# EasyEDA Pro project TJMakes_LiPo_Manager.eprj

# Schematic schematic1
Create Date: 2024-02-23; Page Name: P1; Project Name: TJMakes_LiPo_Manager; Schematic Name: schematic1; Update Date: 2024-02-23; Company: EasyEDA.com; Drawn: EasyEDA; Page Size: A4; Part Number: JLCPCB-002; Reviewed: EasyEDA; Version: V0.1
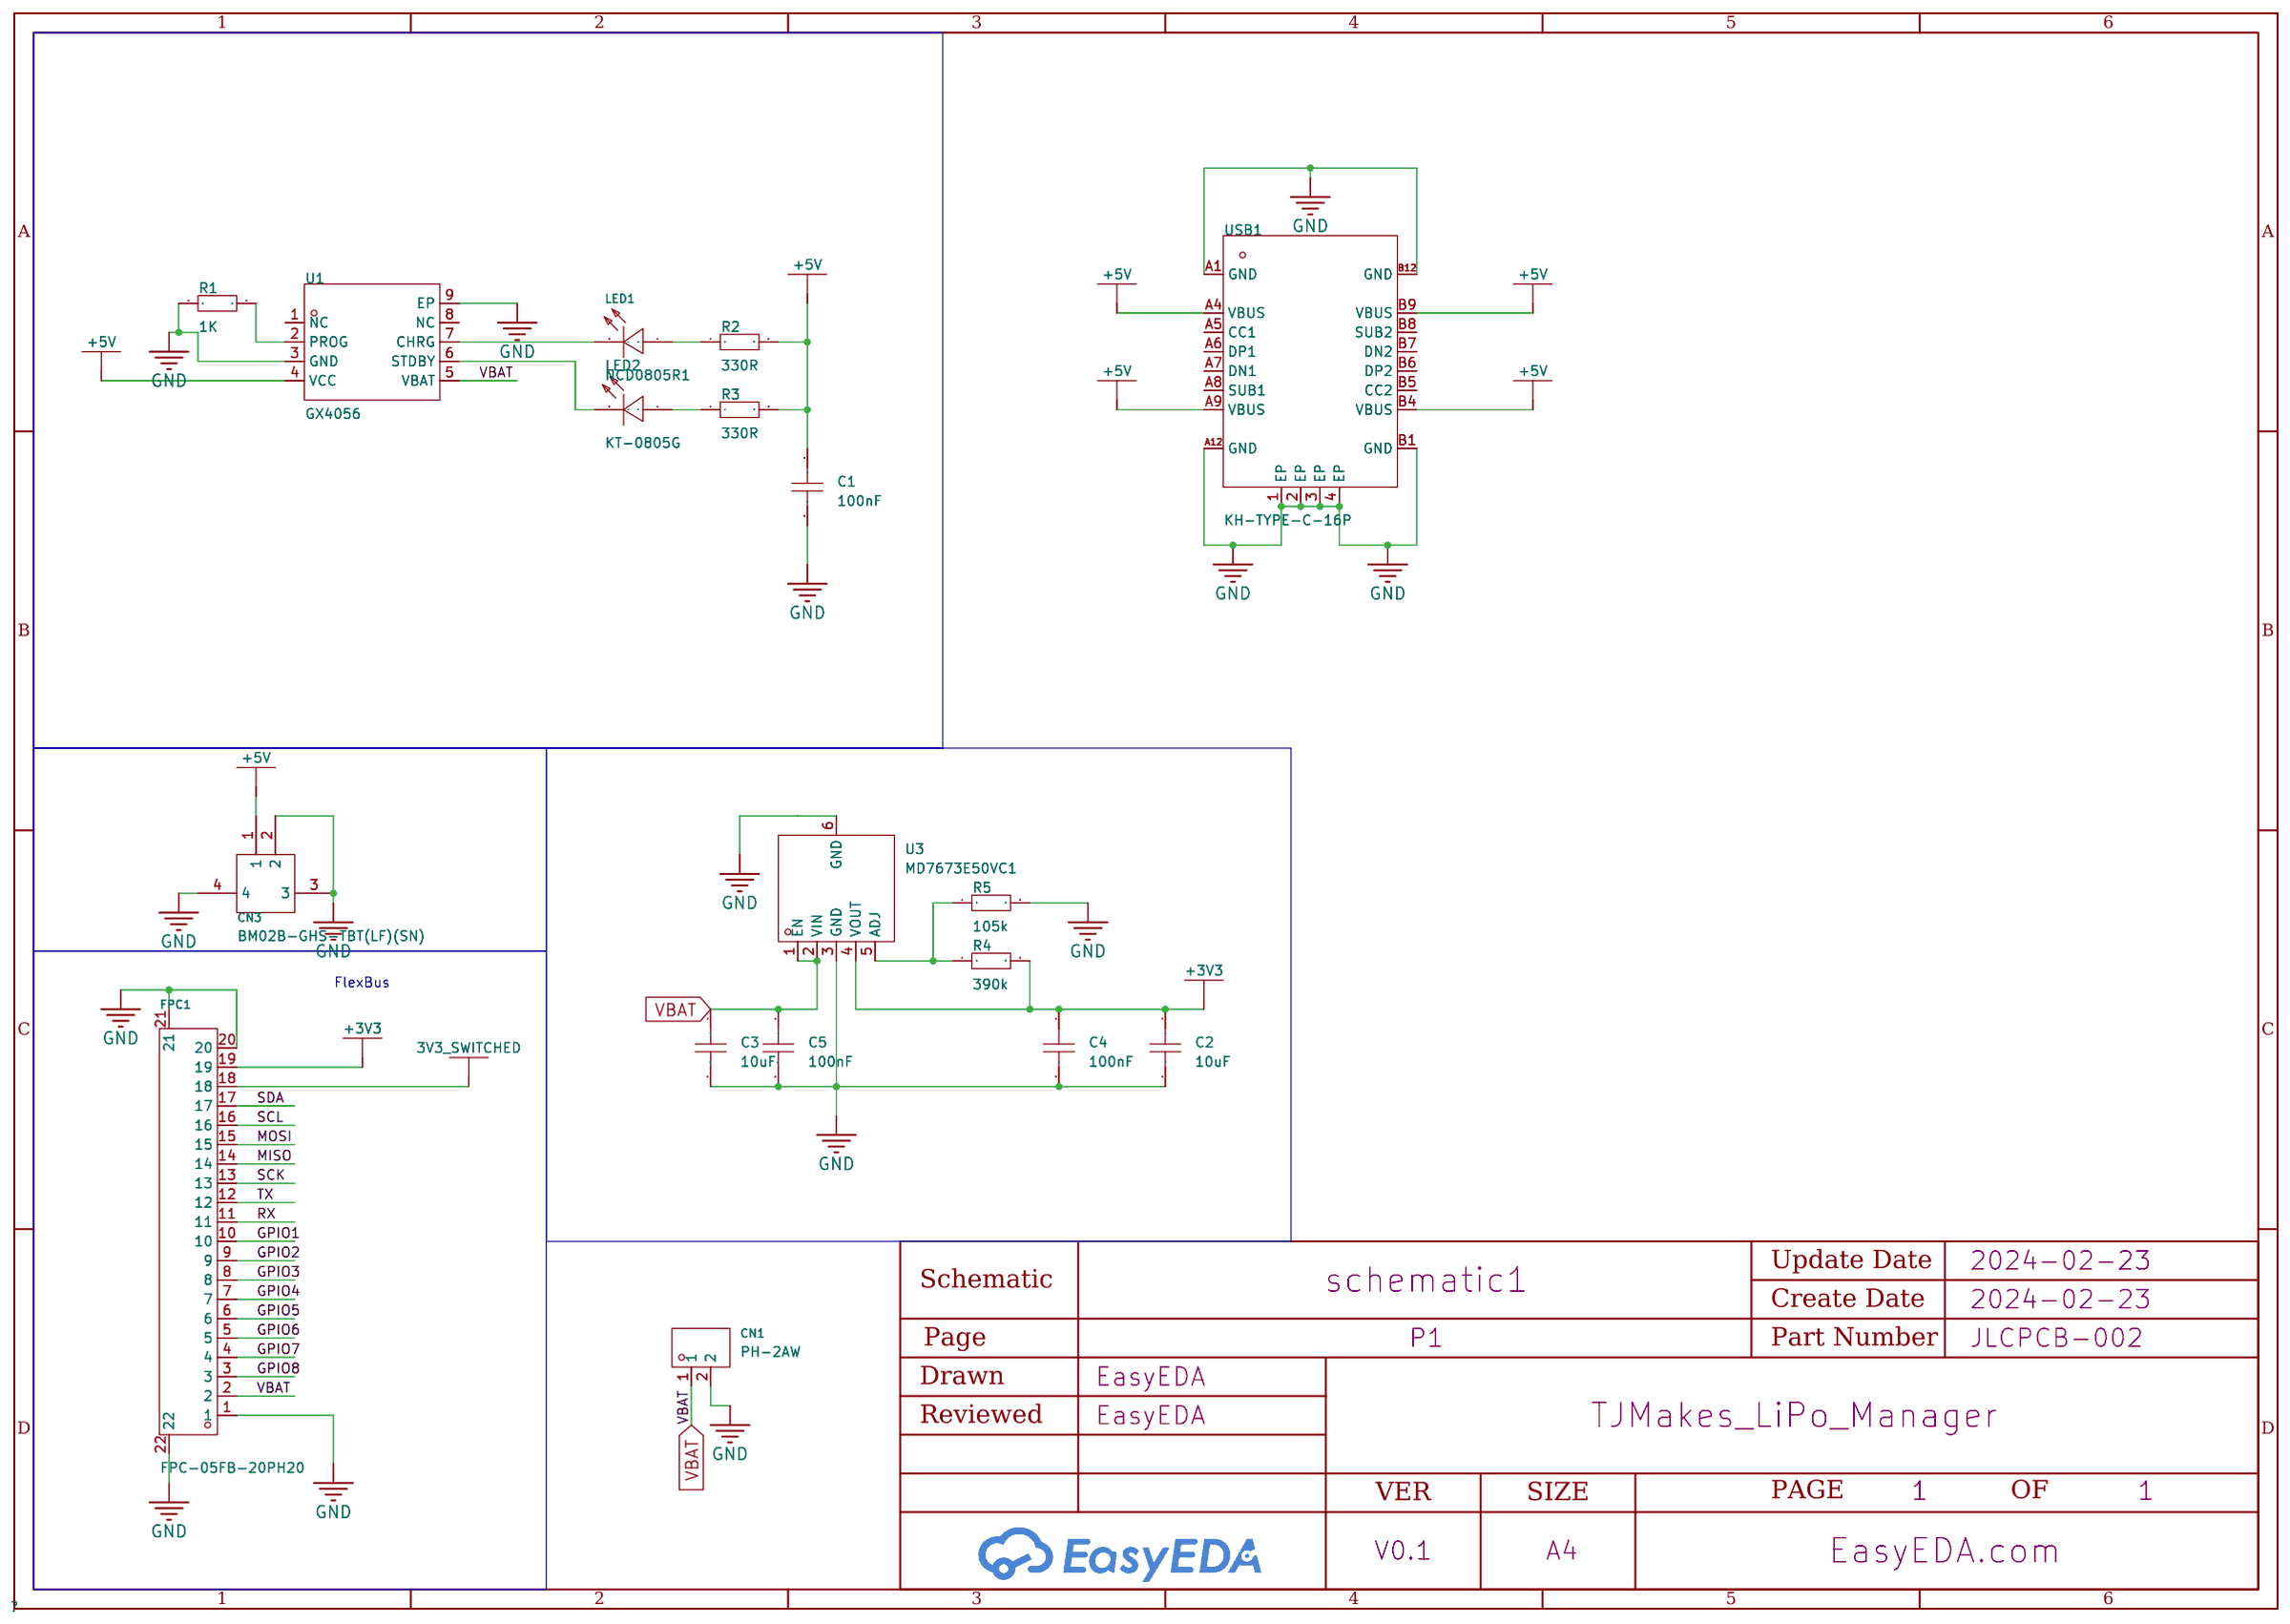
[diagram p0: schematic sheet]

## Parts
C1  100nF  [C0603]
C2  10uF  [C0603]
C3  10uF  [C0603]
C4  100nF  [C0603]
C5  100nF  [C0603]
CN1  PH-2AW  [CONN-TH_PH-2AW]
CN3  BM02B-GHS-TBT(LF)(SN)  [CONN-SMD_2P-P1.25_BM02B-GHS-TBT-LF-SN]
FPC1  FPC-05FB-20PH20  [FPC-SMD_20P-P0.50_FPC-05FB-20PH20]
LED1  NCD0805R1  [LED0805-R-RD]
LED2  KT-0805G  [LED0805-R-RD]
R1  1K  [R0603]
R2  330R  [R0603]
R3  330R  [R0603]
R4  390k  [R0603]
R5  105k  [R0603]
U1  GX4056  [ESOP-8_L4.9-W3.9-P1.27-LS6.0-BL-EP]
U3  MD7673E50VC1  [TO-263-5_L10.2-W8.9-P1.70-BR]
USB1  KH-TYPE-C-16P  [USB-C-SMD_KH-TYPE-C-16P]

## Library data of the parts
C1-C5 = CAP_0603: Supplier Footprint: 0603
CN1 = PH-2AW_C722769: Pins Structure:1x2P Pitch:2mm Mounting Style:Right-Angle Row Spacing:- Number of Pins:2P Number of Rows:1 Number of PINs Per Row:2 Reference Series:- Current Rating (Max):2A Operating Temperature Range:-25℃~+85℃ Operating Temperature Range:-25℃~+85℃; LCSC Part Name: 1x2P 间距:2mm 弯插; Supplier Part: C722769; Manufacturer: CAX(创都); Supplier Footprint: 弯插,P=2mm; JLCPCB Part Class: Extended Part; Datasheet: https://atta.szlcsc.com/upload/public/pdf/source/20200902/C722754_1EABA69888C87343FC10590ADF2409DD.pdf; Supplier: LCSC; Pins Structure: 1x2P; Pitch: 2mm; Mounting Style: Right-Angle; Number of Pins: 2P; Number of Rows: 1; Number of PINs Per Row: 2; Current Rating (Max): 2A; Operating Temperature Range: -25℃~+85℃
CN3 = BM02B-GHS-TBT(LF)(SN)_C161690: Pins Structure:1x2P Pitch:1.25mm Mounting Style:- Reference Series:GH Number of Pins:2P Number of Rows:1 Number of PINs Per Row:2 Row Spacing:- Contact Material:Phosphor bronze; LCSC Part Name: 系列:GH 间距:1.25mm 1x2P; Supplier Part: C161690; Manufacturer: JST; Supplier Footprint: SMD,P=1.25mm; JLCPCB Part Class: Extended Part; Datasheet: https://atta.szlcsc.com/upload/public/pdf/source/20181009/C265379_627E5111B25906DAAB327E382701D435.pdf; Supplier: LCSC; Pins Structure: 1x2P; Pitch: 1.25mm; Reference Series: GH; Number of Pins: 2P; Number of Rows: 1; Number of PINs Per Row: 2; Contact Material: Phosphor bronze
FPC1 = FPC-05FB-20PH20: Pitch:0.5mm Number of Contacts:20P Locking Feature:Clamshell FFC, FCB Thickness:0.3mm FFC, FCB Thickness:0.3mm Contact Type:Double-sided contacts/up and down connection Mounting Type:Surface Mount Height Above Board:2mm Operating Temperature Range:-25℃~+8; LCSC Part Name: 间距:0.5mm P数:20P 翻盖式 双侧触点/上下接; Supplier Part: C2856830; Manufacturer: XUNPU(讯普); Supplier Footprint: SMD,P=0.5mm,卧贴; JLCPCB Part Class: Extended Part; Datasheet: https://atta.szlcsc.com/upload/public/pdf/source/20210922/C2856830_32DC95BE77527398880E7D75F765EF2A.pdf; Supplier: LCSC; Pitch: 0.5mm; Number of Contacts: 20P; Locking Feature: Clamshell; FFC, FCB Thickness: 0.3mm; Contact Type: Double-sided contacts/up and down connection; Mounting Type: Surface Mount; Height Above Board: 2mm; Operating Temperature Range: -25℃~+85℃
LED1 = NCD0805R1_C84256: Lamp Holder Type:- Emitted Color:Red Forward Voltage (VF):1.6V~2.6V Forward Voltage (VF):1.6V~2.6V Power Dissipation:65mW Forward Current:20mA Dominant Wavelength:615nm~630nm Dominant Wavelength:615nm~630nm Peak Wavelength:- Diode Configuration:独立二极管 Lens; Supplier Part: C84256; Manufacturer: 国星光电; Supplier Footprint: 0805; JLCPCB Part Class: Basic Part; Datasheet: https://atta.szlcsc.com/upload/public/pdf/source/20200820/C84256_F0A75A43B3EAD75808600A0514C76B99.pdf; Supplier: LCSC; Emitted Color: Red; Forward Voltage (VF): 1.6V~2.6V; Power Dissipation: 65mW; Forward Current: 20mA; Dominant Wavelength: 615nm~630nm; Diode Configuration: 独立二极管; Lens Color: 无色透明; Luminous Intensity: 67mcd~195mcd; Viewing Angle: 130°; Operating Temperature: -30℃~+85℃
LED2 = KT-0805G: Emitted Color:Emerald Diode Configuration:- Lamp Holder Type:- Forward Voltage (VF):- Forward Voltage (VF):- Forward Current:- Power Dissipation:- Lens Color:- Dominant Wavelength:- Dominant Wavelength:- Peak Wavelength:- Color Temperature:- Color Tempera; LCSC Part Name: 0805 翠绿 高亮; Supplier Part: C2297; Manufacturer: KENTO; Supplier Footprint: 0805; JLCPCB Part Class: Basic Part; Datasheet: https://atta.szlcsc.com/upload/public/pdf/source/20170209/1486607340485.pdf; Supplier: LCSC; Emitted Color: Emerald
R1-R5 = Res_0603: Supplier Footprint: 0603
U1 = GX4056: Maximum Charge Current:1000mA; Supplier Part: C5259236; Manufacturer: 国芯佳品; Supplier Footprint: SOP-8-EP; JLCPCB Part Class: Extended Part; Datasheet: https://atta.szlcsc.com/upload/public/pdf/source/20221111/1186739FA5174D5673D9C2FF440403FD.pdf; Supplier: LCSC; Maximum Charge Current: 1000mA
U3 = MD7673E50VC1: Output Type: Maximum Input Voltage:6V Output Voltage:1.2V~5V Output Voltage:1.2V~5V MAX Output Current:2A Output Polarity:Positive electrode Number of Outputs:1; LCSC Part Name: 输入6V 输出1.2V~5V 2000mA; Supplier Part: C920528; Manufacturer: 明达微; Supplier Footprint: TO-263-5; JLCPCB Part Class: Extended Part; Datasheet: https://atta.szlcsc.com/upload/public/pdf/source/20201124/C920528_9A3F83070614AE6999C6B638A60BE80A.pdf; Supplier: LCSC; Maximum Input Voltage: 6V; Output Voltage: 1.2V~5V; MAX Output Current: 2A; Output Polarity: Positive electrode; Number of Outputs: 1
USB1 = KH-TYPE-C-16P: Connector Type:Type-C Standard:- Gender:Female Number of Ports:1 Number of Contacts:16P Mounting Style:卧贴 Current Rating - Power (Max):3A Operating Temperature Range:-40℃~+85℃ Operating Temperature Range:-40℃~+85℃; LCSC Part Name: Type-C 母 卧贴; Supplier Part: C709357; Manufacturer: kinghelm(金航标); Supplier Footprint: SMD; JLCPCB Part Class: Extended Part; Datasheet: https://atta.szlcsc.com/upload/public/pdf/source/20200911/C709357_AA8DCEB38BB20E3035A7ED7AE7667837.pdf; Supplier: LCSC; Connector Type: Type-C; Gender: Female; Number of Ports: 1; Number of Contacts: 16P; Mounting Style: 卧贴; Current Rating - Power (Max): 3A; Operating Temperature Range: -40℃~+85℃

## Nets
3V3_SWITCHED: FPC1.18
+3V3: C2.1 C4.1 FPC1.19 R4.2 U3.4(VOUT)
+5V: C1.1 CN3.1 R2.2 R3.2 U1.4(VCC) USB1.A4(VBUS) USB1.A9(VBUS) USB1.B4(VBUS) USB1.B9(VBUS)
GND: C1.2 C2.2 C3.2 C4.2 C5.2 CN1.2 CN3.2 CN3.3 CN3.4 FPC1.1 FPC1.20 FPC1.21 FPC1.22 R1.1 R5.2 U1.3(GND) U1.9(EP) U3.3(GND) U3.6(GND) USB1.1(EP) USB1.2(EP) USB1.3(EP) USB1.4(EP) USB1.A1(GND) USB1.A12(GND) USB1.B1(GND) USB1.B12(GND)
VBAT: C3.1 C5.1 CN1.1 FPC1.2 U1.5(VBAT) U3.1(EN) U3.2(VIN)
GPIO1: FPC1.10
GPIO2: FPC1.9
GPIO3: FPC1.8
GPIO4: FPC1.7
GPIO5: FPC1.6
GPIO6: FPC1.5
GPIO7: FPC1.4
GPIO8: FPC1.3
MISO: FPC1.14
MOSI: FPC1.15
RX: FPC1.11
SCK: FPC1.13
SCL: FPC1.16
SDA: FPC1.17
TX: FPC1.12
$1N4723: R1.2 U1.2(PROG)
$1N4935: LED1.2(-) U1.7(CHRG)
$1N4938: LED2.2(K) U1.6(STDBY)
$1N5268: LED1.1(+) R2.1
$1N5271: LED2.1(A) R3.1
$1N7197: R4.1 R5.1 U3.5(ADJ)

Not connected (* = marked no-connect by the designer): U1 1(NC) 8(NC); USB1 A5(CC1) A6(DP1) A7(DN1) A8(SUB1) B5(CC2) B6(DP2) B7(DN2) B8(SUB2)

## Notes on the sheet
- FlexBus

# Board PCB1
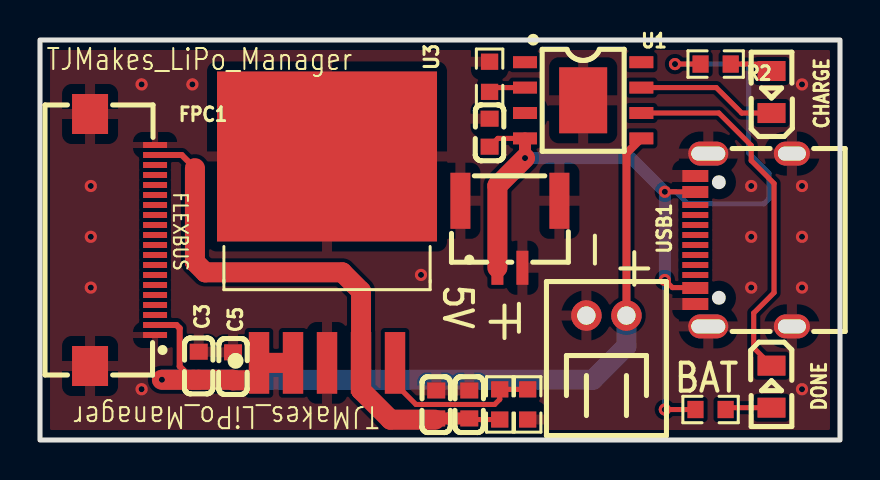
[diagram p1: board, top side]
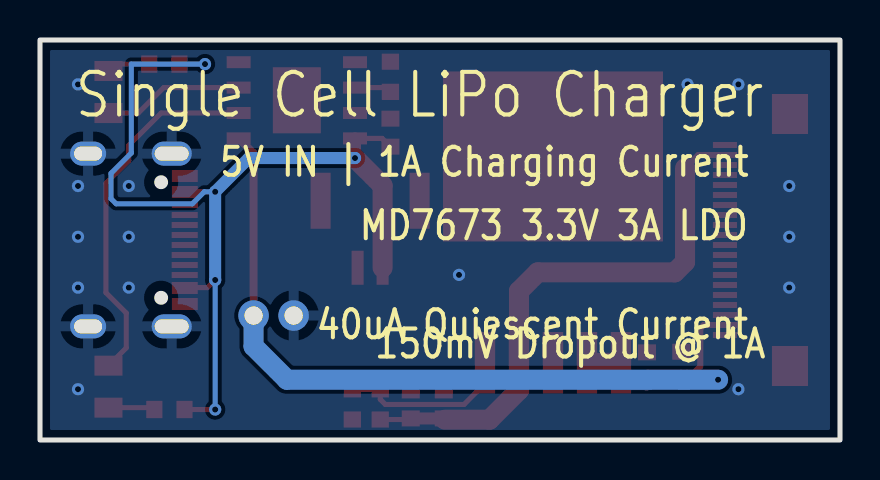
[diagram p2: board, bottom side, seen from below]

Outline 40 x 20 mm; copper layers: Top Layer, Bottom Layer. Coordinates in mm from the lower left corner of the outline.
Outline path: rectangle 0,20 40,0
Stack: Top Layer 0.035mm / Dielectric1 1.51mm FR4 er 4.5 / Bottom Layer 0.035mm

## Design rules (mm)
template: JLCPCB Capability(Two Layers Board)
spacing copperThickness1oz (default): track to track 0.102, other pairs 0.152 to 0.3
spacing copperThickness2oz: track to track 0.203, other pairs 0.152 to 0.3
track width copperThickness1oz (default): min 0.127, default 0.254, max 2.54
track width copperThickness2oz: min 0.203, default 0.254, max 2.54
differential pair differentialPair (default): width min 0.127, default 0.254, max 2.54; gap min 0.152, default 0.152
via viaSize (default): diameter min 0.5, default 0.61, max 10; hole min 0.3, default 0.305, max 6.3

## Placement (name value [footprint] x y rotation side)
C1  100nF  [C0603]  22.48 15.37 90 top
C2  10uF  [C0603]  21.46 1.78 90 top
C3  10uF  [C0603]  7.94 3.71 90 top
C4  100nF  [C0603]  19.81 1.78 90 top
C5  100nF  [C0603]  9.65 3.68 90 top
CN1  PH-2AW  [CONN-TH_PH-2AW]  28.32 6.22 0 top
CN3  BM02B-GHS-TBT(LF)(SN)  [CONN-SMD_2P-P1.25_BM02B-GHS-TBT-LF-SN]  23.5 10.29 180 top
FPC1  FPC-05FB-20PH20  [FPC-SMD_20P-P0.50_FPC-05FB-20PH20]  4.13 10 270 top
LED1  NCD0805R1  [LED0805-R-RD]  36.58 17.4 90 top
LED2  KT-0805G  [LED0805-R-RD]  36.58 2.67 270 top
R1  1K  [R0603]  22.48 18.16 270 top
R2  330R  [R0603]  33.78 18.8 180 top
R3  330R  [R0603]  33.53 1.52 180 top
R4  390k  [R0603]  22.99 1.78 270 top
R5  105k  [R0603]  24.38 1.78 270 top
U1  GX4056  [ESOP-8_L4.9-W3.9-P1.27-LS6.0-BL-EP]  27.16 16.98 270 top
U3  MD7673E50VC1  [TO-263-5_L10.2-W8.9-P1.70-BR]  14.35 9.02 270 top
USB1  KH-TYPE-C-16P  [USB-C-SMD_KH-TYPE-C-16P]  35.18 10 90 top

## Footprints (pads in the part's own frame, mm; a bottom-side part is the same pattern mirrored in y, then rotated)
C0603
  rect 0.8x0.9 smd: 1(-0.7,0) 2(0.7,0)
CONN-SMD_2P-P1.25_BM02B-GHS-TBT-LF-SN
  rect 0.6x1.7 smd: 1(0.625,1.675) 2(-0.625,1.675)
  rect 1x2.8 smd: 3(2.475,-1.675) 4(-2.475,-1.675)
CONN-TH_PH-2AW
  round 1.524 hole 0.914: 1(1.001,0) 2(-1.001,0)
ESOP-8_L4.9-W3.9-P1.27-LS6.0-BL-EP
  rect 0.6x1.2 smd: 1(-1.905,-2.909) 2(-0.635,-2.909) 3(0.635,-2.909) 4(1.905,-2.909) 5(1.905,2.909) 6(0.635,2.909) 7(-0.635,2.909) 8(-1.905,2.909)
  rect 3.3x2.4 smd: 9(0,0)
FPC-SMD_20P-P0.50_FPC-05FB-20PH20
  rect 0.3x1.2 smd: 1(4.75,1.625) 2(4.25,1.625) 3(3.75,1.625) 4(3.25,1.625) 5(2.75,1.625) 6(2.25,1.625) 7(1.75,1.625) 8(1.25,1.625) 9(0.75,1.625) 10(0.25,1.625) 11(-0.25,1.625) 12(-0.75,1.625) 13(-1.25,1.625) 14(-1.75,1.625) 15(-2.25,1.625) 16(-2.75,1.625) 17(-3.25,1.625) 18(-3.75,1.625) 19(-4.25,1.625) 20(-4.75,1.625)
  rect 2x1.8 smd: 21(-6.3,-1.625) 22(6.3,-1.625)
LED0805-R-RD
  rect 1x1.399 smd: 1(1.05,0) 2(-1.05,0)
R0603
  rect 0.806x0.864 smd: 1(-0.753,0) 2(0.753,0)
TO-263-5_L10.2-W8.9-P1.70-BR
  rect 3.083x1.02 smd: 1(5.16,-3.4) 2(5.16,-1.7) 3(5.16,0) 4(5.16,1.7) 5(5.16,3.4)
  rect 8.5x11 smd: 6(-5.16,0)
USB-C-SMD_KH-TYPE-C-16P
  oval 1.2x2 hole 0.7x1.7: 1(-4.32,1.765) 2(4.32,1.765)
  oval 1.2x1.8 hole 0.7x1.4: 3(-4.32,-2.415) 4(4.32,-2.415)
  rect 0.3x1.3 smd: A1(-3.35,2.415) A4(-2.55,2.415) A5(-1.25,2.415) A6(-0.25,2.415) A7(0.25,2.415) A8(1.25,2.415) A9(2.55,2.415) A12(3.35,2.415) B1(3.05,2.415) B4(2.25,2.415) B5(1.75,2.415) B6(0.75,2.415) B7(-0.75,2.415) B8(-1.75,2.415) B9(-2.25,2.415) B12(-3.05,2.415)

## Nets
As in the schematic.

Pads without a net: U1 1 8; USB1 A5 A6 A7 A8 B5 B6 B7 B8

## Via types
v1: diameter 0.61, hole 0.304, Top Layer to Bottom Layer, 15 vias
v2: diameter 0.61, hole 0.305, Top Layer to Bottom Layer, 6 vias

## Routing (per net, layer and track width the routed paths; a pad name or vN(x,y) marks a point on that pad's centre or on a via; arc(x,y) is an arc through that point)
+3V3: length 28.4
  Top Layer w0.254: C2.1 21.52,1.02 R4.2
  Top Layer w0.3: 7.75,13.59 7.09,14.25 FPC1.19
  Top Layer w0.6: C2.1 C4.1 19.75,1.02
  Top Layer w1: 7.75,13.59 7.75,8.9 8.26,8.38 15.11,8.38 16.05,7.44 U3.4 16.05,2.49 17.53,1.02 19.75,1.02
+5V: length 50.3
  Top Layer w0.254: C1.1 22.89,15.08 U1.4 ; v2(31.24,1.52) R3.2 ; v2(31.75,18.8) R2.2 ; v2(31.24,8) 31.62,7.62 33.05,7.62 ; 32.76,12.41 v2(31.24,12.41)
  Top Layer w0.6: v2(24.25,14.1) U1.4
  Top Layer w1: CN3.1 22.87,12.72 v2(24.25,14.1)
  Bottom Layer w0.254: v2(31.24,1.52) v2(31.24,8) ; v2(31.24,12.41) 31.79,12.41 32.39,11.81 36.2,11.81 36.45,12.06 36.45,13.33 35.43,14.35 35.43,18.8 v2(31.75,18.8)
  Bottom Layer w0.6: v2(31.24,8) v2(31.24,12.41) 29.56,14.1 v2(24.25,14.1)
GND:
  vias: v1(2.54,12.7) v1(2.54,10.16) v1(2.54,7.62) v1(5.08,17.78) v1(5.08,2.54) v1(7.62,17.78) v1(19.05,8.25) v1(35.56,12.7) v1(35.56,10.16) v1(35.56,7.62) v1(38.1,17.78) v1(38.1,12.7) v1(38.1,10.16) v1(38.1,7.62) v1(38.1,2.54)
VBAT: length 46.1
  Top Layer w0.3: 7.65,3.01 6.99,3.68 6.99,5.59 6.82,5.75 5.62,5.75
  Top Layer w0.4: U1.5 29.32,14.33 CN1.1
  Top Layer w1: v2(6.1,3.01) C3.1 9.62,3.01 C5.1 10.6,2.98 10.95,3.33 U3.1 U3.2
  Bottom Layer w1: v2(6.1,3.01) 27.65,3.01 29.32,4.68 CN1.1
$1N4723: length 1.9
  Top Layer w0.254: U1.2 22.69,17.62 R1.2
$1N4935: length 7
  Top Layer w0.254: LED1.2 35.09,16.35 33.81,17.62 U1.7
$1N4938: length 18.4
  Top Layer w0.254: U1.6 33.94,16.35 35.56,14.73 35.56,13.97 36.7,12.83 36.7,7.37 35.69,6.35 35.69,4.61 LED2.2
$1N5268: length 2.2
  Top Layer w0.254: R2.1 36.23,18.8 LED1.1
$1N5271: length 2.3
  Top Layer w0.254: LED2.1 34.37,1.62 R3.1
$1N7197: length 8.7
  Top Layer w0.254: R5.1 R4.1 22.99,2.03 22.73,1.78 18.8,1.78 17.75,2.82 U3.5

## Copper pours and planes (outline as drawn; the poured copper is in the pictures)
GND on Top Layer: 0,20 40,20 40,0 0,0
GND on Bottom Layer: 0,20 40,20 40,0 0,0

## Text on the board
Bottom Silkscreen Layer: 150mV Dropout @ 1A | MD7673 3.3V 3A LDO | 40uA Quiescent Current | 5V IN | 1A Charging Current | Single Cell LiPo Charger
Top Silkscreen Layer: FLEXBUS | CHARGE | DONE | TJMakes_LiPo_Manager | BAT | 5V | + | -
